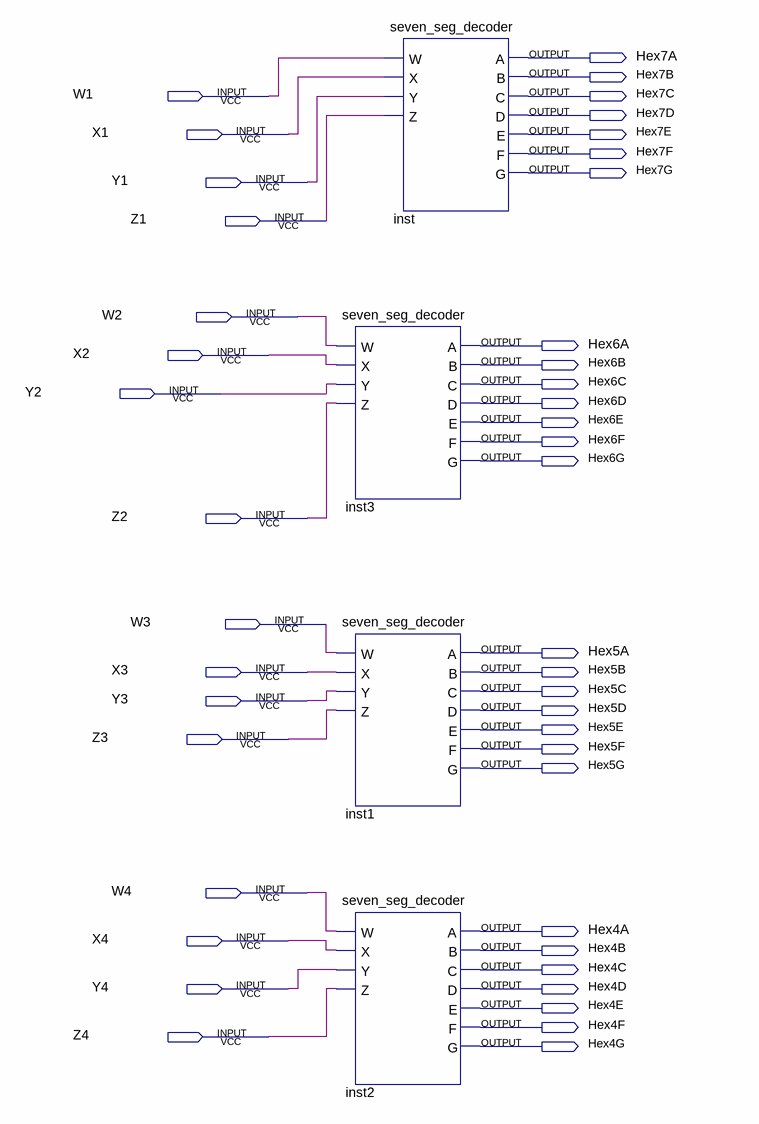
[diagram p0: schematic sheet]
// Quartus schematic lab5step1.bdf as structural Verilog: 4 symbols, 44 pins
module lab5step1 (
  input  W1,
  input  X1,
  input  Y1,
  input  Z1,
  input  W2,
  input  X2,
  input  Y2,
  input  Z2,
  input  W3,
  input  X3,
  input  Y3,
  input  Z3,
  input  W4,
  input  X4,
  input  Y4,
  input  Z4,
  output Hex7A,
  output Hex7B,
  output Hex7C,
  output Hex7D,
  output Hex7E,
  output Hex7F,
  output Hex7G,
  output Hex6A,
  output Hex6B,
  output Hex6C,
  output Hex6D,
  output Hex6E,
  output Hex6F,
  output Hex6G,
  output Hex5A,
  output Hex5B,
  output Hex5C,
  output Hex5D,
  output Hex5E,
  output Hex5F,
  output Hex5G,
  output Hex4A,
  output Hex4B,
  output Hex4C,
  output Hex4D,
  output Hex4E,
  output Hex4F,
  output Hex4G
);

  seven_seg_decoder inst (
    .W(W1), .X(X1), .Y(Y1), .Z(Z1), .A(Hex7A), .B(Hex7B), .C(Hex7C), .D(Hex7D), .E(Hex7E), .F(Hex7F),
    .G(Hex7G));
  seven_seg_decoder inst3 (
    .W(W2), .X(X2), .Y(Y2), .Z(Z2), .A(Hex6A), .B(Hex6B), .C(Hex6C), .D(Hex6D), .E(Hex6E), .F(Hex6F),
    .G(Hex6G));
  seven_seg_decoder inst1 (
    .W(W3), .X(X3), .Y(Y3), .Z(Z3), .A(Hex5A), .B(Hex5B), .C(Hex5C), .D(Hex5D), .E(Hex5E), .F(Hex5F),
    .G(Hex5G));
  seven_seg_decoder inst2 (
    .W(W4), .X(X4), .Y(Y4), .Z(Z4), .A(Hex4A), .B(Hex4B), .C(Hex4C), .D(Hex4D), .E(Hex4E), .F(Hex4F),
    .G(Hex4G));
endmodule
